# EasyEDA Pro project EasyEDA_Pro_Project_0.02.epro

# Schematic Schematic1
Board Name: Board1; Create Date: 2025-01-02; Page Name: P1; Project Name: MCU Dev Board - Microchip AVR64DU28; Schematic Name: Schematic1; Update Date: 2025-01-03; Company: EasyEDA.com; Page Size: A4; Version: V1.0
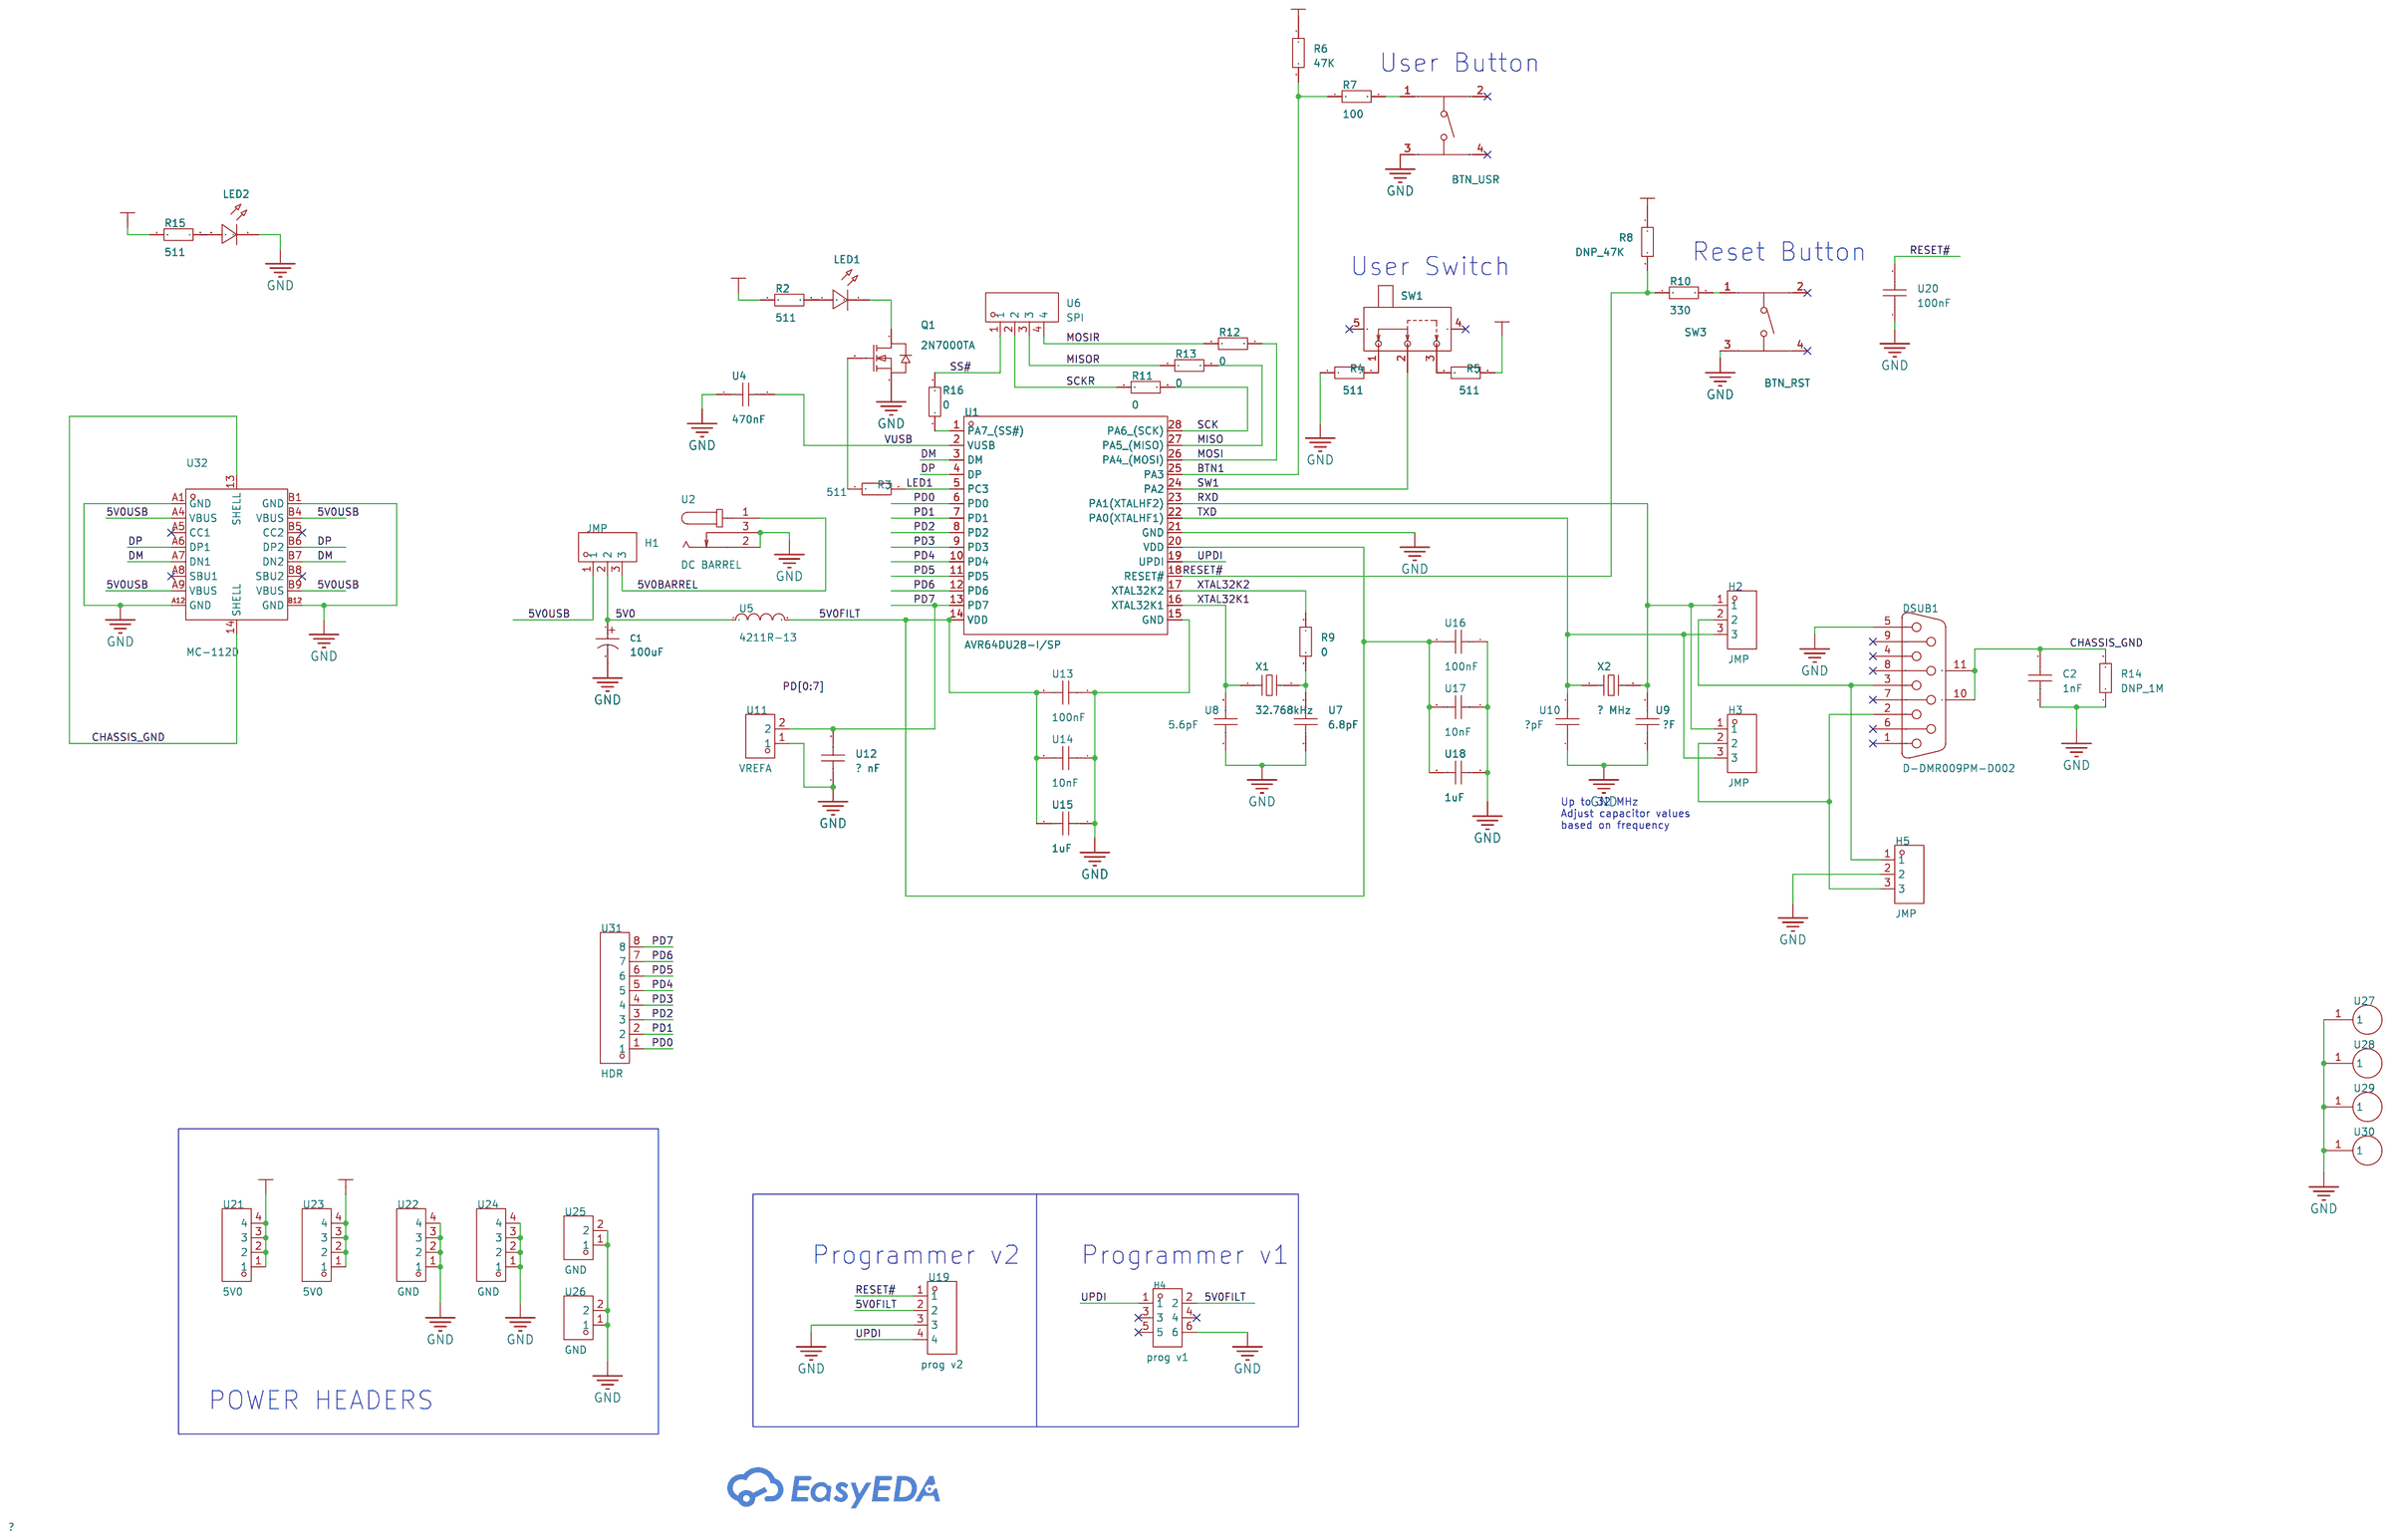
[diagram p0: schematic sheet]

## Parts
BTN_USR  GT-TC075B-H070-L1  [KEY-TH_4P-L4.5-W4.5-P3.00-LS5.8]
C1  100uF  [CAP-TH_BD5.0-P2.00-D0.8-FD]
C2  1nF  [CAP-TH_L6.0-W3.5-P7.50-D1.0]
DSUB1  D-DMR009PM-D002  [DSUB-TH_DMR-9P]
H1  JMP  [HDR-TH_3P-P2.54-V-M-1]
H2  JMP  [HDR-TH_3P-P2.54-V-M-1]
H3  JMP  [HDR-TH_3P-P2.54-V-M-1]
H4  prog v1  [HDR-TH_6P-P2.54-V-M-R2-C3-S2.54]
H5  JMP  [HDR-TH_3P-P2.54-V-M-1]
LED1  -  [LED-TH_BD3.0-P2.54-FD]
LED2  -  [LED-TH_BD3.0-P2.54-FD]
Q1  2N7000TA  [TO-92-3_L4.8-W3.7-P2.54-L]
R2  511  [RES-TH_BD1.8-L3.2-P7.20-D0.4]
R3  511  [RES-TH_BD1.8-L3.2-P7.20-D0.4]
R4  511  [RES-TH_BD1.8-L3.2-P7.20-D0.4]
R5  511  [RES-TH_BD1.8-L3.2-P7.20-D0.4]
R6  47K  [RES-TH_BD1.8-L3.2-P7.20-D0.4]
R7  100  [RES-TH_BD1.8-L3.2-P7.20-D0.4]
R8  DNP_47K  [RES-TH_BD1.8-L3.2-P7.20-D0.4]
R9  0  [RES-TH_BD1.8-L3.2-P7.20-D0.4]
R10  330  [RES-TH_BD1.8-L3.2-P7.20-D0.4]
R11  0  [RES-TH_BD1.8-L3.2-P7.20-D0.4]
R12  0  [RES-TH_BD1.8-L3.2-P7.20-D0.4]
R13  0  [RES-TH_BD1.8-L3.2-P7.20-D0.4]
R14  DNP_1M  [R_AXIAL-0.4]
R15  511  [RES-TH_BD1.8-L3.2-P7.20-D0.4]
R16  0  [RES-TH_BD1.8-L3.2-P7.20-D0.4]
SW1  SS-12D07G4  [SW-TH_DEALON_SS-12D02-VGX]
SW3  BTN_RST  [KEY-TH_4P-L4.5-W4.5-P3.00-LS5.8]
U1  AVR64DU28-I/SP  [SPDIP-28_L34.7-W7.2-P2.54-LS7.9-BL]
U2  DC BARREL  [DC-IN-TH_DC-005-2.0_C22459640]
U4  470nF  [CAP-TH_L4.8-W2.4-P5.08-D0.6]
U5  4211R-13  [IND-TH_BD3.5-L4.4_4211R-13]
U6  SPI  [HDR-TH_4P-P2.00-V-M]
U7  6.8pF  [CAP-TH_L4.8-W2.4-P5.08-D0.6]
U8  5.6pF  [CAP-TH_L4.8-W2.4-P5.08-D0.6]
U9  ?F  [CAP-TH_L4.8-W2.4-P5.08-D0.6]
U10  ?pF  [CAP-TH_L4.8-W2.4-P5.08-D0.6]
U11  VREFA  [HDR-TH_2P-P2.00-V-M]
U12  ? nF  [CAP-TH_L4.8-W2.4-P5.08-D0.6]
U13  100nF  [CAP-TH_L4.8-W2.4-P5.08-D0.6]
U14  10nF  [CAP-TH_L4.8-W2.4-P5.08-D0.6]
U15  1uF  [CAP-TH_L4.8-W2.4-P5.08-D0.6]
U16  100nF  [CAP-TH_L4.8-W2.4-P5.08-D0.6]
U17  10nF  [CAP-TH_L4.8-W2.4-P5.08-D0.6]
U18  1uF  [CAP-TH_L4.8-W2.4-P5.08-D0.6]
U19  prog v2  [HDR-TH_4P-P2.00-V-M]
U20  100nF  [CAP-TH_L4.8-W2.4-P5.08-D0.6]
U21  5V0  [HDR-TH_4P-P2.00-V-M]
U22  GND  [HDR-TH_4P-P2.00-V-M]
U23  5V0  [HDR-TH_4P-P2.00-V-M]
U24  GND  [HDR-TH_4P-P2.00-V-M]
U25  GND  [HDR-TH_2P-P2.00-V-M]
U26  GND  [HDR-TH_2P-P2.00-V-M]
U27  -  [Standoff 2.0mm]
U28  -  [Standoff 2.0mm]
U29  -  [Standoff 2.0mm]
U30  -  [Standoff 2.0mm]
U31  HDR  [HDR-TH_8P-P2.54-V-M]
U32  MC-112D  [USB-C-TH_HANBO_MC-112D]
X1  32.768kHz  [OSC-TH_BD2.0-P0.70-D0.3]
X2  ? MHz  [OSC-TH_BD2.0-P0.70-D0.3]

## Library data of the parts
BTN_USR SW3 = GT-TC075B-H070-L1: Circuit:SPST Actuator Style:Round Button Operating Force:250gf Mounting Style:Straight Switch Length:4.5mm Switch Width:4.5mm Switch Height:7mm Strike Gundam:不带 Contact Current:50mA Voltage Rating (DC):12V Insulation Resistance:100MΩ Actuator/Cap Color:Bl; LCSC Part Name: 4.5*4.5*7mm 直插 轻触开关; Supplier Part: C2829947; Manufacturer: G-Switch(品赞); Supplier Footprint: 插件; JLCPCB Part Class: Extended Part; Datasheet: https://atta.szlcsc.com/upload/public/pdf/source/20210430/C2829936_0F431FDF8267C5A6C94C8ADDACF09981.pdf; Supplier: LCSC; Circuit: SPST; Actuator Style: Round Button; Operating Force: 250gf; Mounting Style: Straight; Switch Length: 4.5mm; Switch Width: 4.5mm; Switch Height: 7mm; Strike Gundam: 不带; Contact Current: 50mA; Voltage Rating (DC): 12V; Insulation Resistance: 100MΩ; Actuator/Cap Color: Black; With Lamp: No; Pin Style: PCPin; Mechanical Life: 10万次; Operating Temperature: -30℃~+85℃
C1 = KS107M010D07RR0VH2FP0: Capacitance:100uF Tolerance:±20% Tolerance:±20% Rated Voltage: Ripple Current:50mA@120Hz Equivalent Series Resistance(ESR):- Lead Spacing: φD: L: Lifetime @ Temp:1000hrs@105℃ Operating Temperature:-40℃~+105℃ Operating Temperature:-40℃~+105℃; LCSC Part Name: 100uF ±20% 10V; Supplier Part: C43315; Manufacturer: CX(承兴); Supplier Footprint: 插件,D5xL7mm; JLCPCB Part Class: Extended Part; Datasheet: https://atta.szlcsc.com/upload/public/pdf/source/20211027/7B10195EF01EB9374BE8935690E3D906.pdf; Supplier: LCSC; Tolerance: ±20%; Ripple Current: 50mA@120Hz; Lifetime @ Temp: 1000hrs@105℃; Operating Temperature: -40℃~+105℃
C2 = Y25E1E102M: Capacitance: Tolerance:±20% Tolerance:±20% Voltage(AC):250V Subclass:; LCSC Part Name: 等级:Y2 1nF ±20% 250V; Supplier Part: C332370; Manufacturer: HEL(鸿志); Supplier Footprint: 插件,P=7.5mm; JLCPCB Part Class: Extended Part; Datasheet: https://atta.szlcsc.com/upload/public/pdf/source/20181130/C332372_EA8D2B597A88A824E44325E038B9D018.pdf; Supplier: LCSC; Tolerance: ±20%; Voltage(AC): 250V
DSUB1 = D-DMR009PM-D002: Connector Type:常规D-Sub Gender:Male Number of Pins:9P Mounting Style:Bend insert Number of Rows:2 Current Rating-Signal (Max):3A Current Rating-Power (Max):- Rated Voltage (Max):- Colour:Black Operating Temperature Range:-50℃~+105℃ Operating Temperature Ra; LCSC Part Name: D-Sub 公 P数:9P; Supplier Part: C141880; Manufacturer: Ckmtw(灿科盟); Supplier Footprint: 弯插; JLCPCB Part Class: Extended Part; Datasheet: https://atta.szlcsc.com/upload/public/pdf/source/20171123/C141880_15114109678101137623.pdf; Supplier: LCSC; Connector Type: 常规D-Sub; Gender: Male; Number of Pins: 9P; Mounting Style: Bend insert; Number of Rows: 2; Current Rating-Signal (Max): 3A; Colour: Black; Operating Temperature Range: -50℃~+105℃
H1-H3 H5 = 12251103CNG0S115001: Pin Structure:1x3P Pitch:2.54mm Row Spacing:- Circluar Pins/Square Pins:Policy Mounting Type:Direct Insert Number of Rows:Single Row Number of Pins:3P Current Rating (Max):3A Voltage Rating (Max):- Length of Mating Pin:6mm Insulation Height:2.5mm Length o; LCSC Part Name: 1x3P 间距:2.54mm 方针 直插; Supplier Part: C429954; Manufacturer: JILN(锦凌); Supplier Footprint: 插件,P=2.54mm; JLCPCB Part Class: Extended Part; Datasheet: https://atta.szlcsc.com/upload/public/pdf/source/20190920/C429964_97CF577D001CBBD1C5ADC89AE690F8A2.pdf; Supplier: LCSC; Pin Structure: 1x3P; Pitch: 2.54mm; Circluar Pins/Square Pins: Policy; Mounting Type: Direct Insert; Number of Rows: Single Row; Number of Pins: 3P; Current Rating (Max): 3A; Length of Mating Pin: 6mm; Insulation Height: 2.5mm; Length of End Connection Pin: 3mm; Contact Material: Brass; Operating Temperature Range: -40℃~+105℃; Soldering Temperature(Max): 200℃; Color: Black
H4 = PH-01291: Pin Structure:2x3P Pitch:2.54mm Row Spacing:2.54mm Circluar Pins/Square Pins:Square Pins Mounting Type:Straight Number of Rows:双排 Number of Pins:6P Current Rating (Max):3A Voltage Rating (Max):- Length of Mating Pin:6mm Insulation Height:2.5mm Length of E; LCSC Part Name: 间距:2.54mm 2x3P 直插 方针; Supplier Part: C2685197; Manufacturer: Liansheng(连盛); Supplier Footprint: 插件,P=2.54mm; JLCPCB Part Class: Extended Part; Datasheet: https://atta.szlcsc.com/upload/public/pdf/source/20210126/C2685197_BCDAC363C191DAD80284D75D76656869.pdf; Supplier: LCSC; Pin Structure: 2x3P; Pitch: 2.54mm; Row Spacing: 2.54mm; Circluar Pins/Square Pins: Square Pins; Mounting Type: Straight; Number of Rows: 双排; Number of Pins: 6P; Current Rating (Max): 3A; Length of Mating Pin: 6mm; Insulation Height: 2.5mm; Length of End Connection Pin: 3mm; Operating Temperature Range: -40℃~+105℃; Color: Black
LED1 LED2 = LED_TH-R_3mm: Supplier Footprint: Through
Q1 = 2N7000TA: Type:1 N-Channel Drain Source Voltage (Vdss): Continuous Drain Current (Id): Drain Source On Resistance (RDS(on)@Vgs,Id):1.2Ω@10V,500mA Power Dissipation (Pd): Gate Threshold Voltage (Vgs(th)@Id):2.1V@1mA Input Capacitance (Ciss@Vds):50pF@25V Reverse Tran; LCSC Part Name: 1个N沟道 耐压:60V 电流:200mA; Supplier Part: C107290; Manufacturer: onsemi(安森美); Supplier Footprint: TO-92-2.54mm; JLCPCB Part Class: Extended Part; Datasheet: https://atta.szlcsc.com/upload/public/pdf/source/20181011/C107290_B31B96F645D839A54C166B69C8A09EDB.pdf; Supplier: LCSC; Type: 1 N-Channel; Drain Source On Resistance (RDS(on)@Vgs,Id): 1.2Ω@10V,500mA; Gate Threshold Voltage (Vgs(th)@Id): 2.1V@1mA; Input Capacitance (Ciss@Vds): 50pF@25V; Reverse Transfer Capacitance (Crss@Vds): 5pF@25V; Operating Temperature: -55℃~+150℃
R2-R13 R15 R16 = Res_AXIAL-1/8W: Supplier Footprint: Through
R14 = Res_AXIAL-1/4W: Supplier Footprint: Through
SW1 = SS-12D07G4: LCSC Part Name: 拨动开关单排两档高度4; Supplier Part: C7471827; Manufacturer: HanElectricity(瀚源); JLCPCB Part Class: Extended Part; Datasheet: https://atta.szlcsc.com/upload/public/pdf/source/20230804/8F380914F6D2310095340BEFBA1166E2.pdf; Supplier: LCSC
U1 = AVR64DB28-I/SP: CPU Core:AVR Program Storage Size:64KB GPIO Ports Number:21 Operating Voltage Range:1.8V~5.5V Operating Voltage Range:1.8V~5.5V CPU Maximum Speed:24MHz Operating Temperature Range:-40℃~+85℃ Operating Temperature Range:-40℃~+85℃ ADC (Bit):12bit DAC (Bit):1; Supplier Part: C5239855; Manufacturer: MICROCHIP(美国微芯); Supplier Footprint: SPDIP-28-300mil; JLCPCB Part Class: Extended Part; Datasheet: https://atta.szlcsc.com/upload/public/pdf/source/20221107/0017966FE6A2719C2BE10DA466CCAD4F.pdf; Supplier: LCSC; CPU Core: AVR; Program Storage Size: 64KB; GPIO Ports Number: 21; Operating Voltage Range: 1.8V~5.5V; CPU Maximum Speed: 24MHz; Operating Temperature Range: -40℃~+85℃; ADC (Bit): 12bit; DAC (Bit): 10bit; Watchdog: 有; Low-Voltage Detect: 有; Internal Oscillator: 有
U2 = DC-005-2.0_C22459640: LCSC Part Name: DC-005-2.0; Supplier Part: C22459640; Manufacturer: HanElectricity(瀚源); Supplier Footprint: 插件; JLCPCB Part Class: Extended Part; Datasheet: https://atta.szlcsc.com/upload/public/pdf/source/20240612/482A6E3C5A13B157BCBF6F540A12A38A.pdf; Supplier: LCSC
U4 U7-U10 U12-U18 U20 = 178MU0009: Capacitance: Tolerance:±10% Tolerance:±10% Voltage Rated: Temperature Coefficient:; LCSC Part Name: 470nF ±10% 50V; Supplier Part: C5632433; Manufacturer: KNSCHA(科尼盛); Supplier Footprint: 插件,P=5.08mm; JLCPCB Part Class: Extended Part; Datasheet: https://atta.szlcsc.com/upload/public/pdf/source/20230506/DCC14A9A0FEAEE97AA63FFA7A16A3B41.pdf; Supplier: LCSC; Tolerance: ±10%
U5 = 4211R-13: Impedance @ Frequency:50Ω@100MHz Circuits:1; Supplier Part: C7015509; Manufacturer: API Delevan; Supplier Footprint: 插件,D3.5xL4.4mm; JLCPCB Part Class: Extended Part; Datasheet: https://atta.szlcsc.com/upload/public/pdf/source/20241031/AC5F627B4ECA19ABE3C427B5589A7B60.pdf; Supplier: LCSC; Impedance @ Frequency: 50Ω@100MHz; Circuits: 1
U6 U19 U21-U24 = P220-1104A0BS087A1: Pin Structure:1x4P Pitch:2mm Row Spacing:2mm Circluar Pins/Square Pins:Square Pins Mounting Type:Straight Number of Rows:Plugin Number of Pins:4P Length of Mating Pin:4mm Insulation Height:2mm Length of End Connection Pin:2.8mm Contact Material: Operating; LCSC Part Name: 1x4P 间距:2mm 方针 直插; Supplier Part: C7494801; Manufacturer: Yxcon(宇熙精密); Supplier Footprint: 插件,P=2mm; JLCPCB Part Class: Extended Part; Supplier: LCSC; Pin Structure: 1x4P; Pitch: 2mm; Row Spacing: 2mm; Circluar Pins/Square Pins: Square Pins; Mounting Type: Straight; Number of Rows: Plugin; Number of Pins: 4P; Length of Mating Pin: 4mm; Insulation Height: 2mm; Length of End Connection Pin: 2.8mm; Operating Temperature Range: -40℃~+105℃; Color: Black
U11 U25 U26 = HX PZ2.0-1x2P ZZ: Pin Structure:1x2P Pitch:2mm Row Spacing:- Circluar Pins/Square Pins:Policy Mounting Type:Direct Insert Number of Rows:Single Row Number of Pins:2P Current Rating (Max):1.5A Voltage Rating (Max):- Length of Mating Pin:3.9mm Insulation Height:2mm Length of; LCSC Part Name: 1x2P 间距:2mm 方针 直插 配套排母：HX PM2.0-1x2P系列 6T材质环保阻燃U认证; Supplier Part: C22438285; Manufacturer: hanxia(韩下); Supplier Footprint: 插件,P=2mm; JLCPCB Part Class: Extended Part; Datasheet: https://atta.szlcsc.com/upload/public/pdf/source/20240522/1FF787A01EEC3A9B4EEF5A5788C49F98.pdf; Supplier: LCSC; Pin Structure: 1x2P; Pitch: 2mm; Circluar Pins/Square Pins: Policy; Mounting Type: Direct Insert; Number of Rows: Single Row; Number of Pins: 2P; Current Rating (Max): 1.5A; Length of Mating Pin: 3.9mm; Insulation Height: 2mm; Length of End Connection Pin: 2.8mm; Contact Material: Phosphor Bronze; Contact Plating: Gold; Operating Temperature Range: -40℃~+105℃; Color: Black
U27-U30 = Standoff 2.0mm
U31 = HB-PH3-25418PB2GOP: Pin Structure:1x8P Pitch:2.54mm Row Spacing:2.54mm Circluar Pins/Square Pins:Policy Mounting Type:Direct Insert Number of Rows:Single Row Number of Pins:8P Current Rating (Max):3A Voltage Rating (Max):250V Length of Mating Pin:6mm Insulation Height:2.54mm; LCSC Part Name: 间距:2.54mm 1x8P 直插 方针; Supplier Part: C6332201; Manufacturer: HANBO(汉博); Supplier Footprint: 插件,P=2.54mm; JLCPCB Part Class: Extended Part; Datasheet: https://atta.szlcsc.com/upload/public/pdf/source/20230803/F72D259687963761DF1B552F3BB84A31.pdf; Supplier: LCSC; Pin Structure: 1x8P; Pitch: 2.54mm; Row Spacing: 2.54mm; Circluar Pins/Square Pins: Policy; Mounting Type: Direct Insert; Number of Rows: Single Row; Number of Pins: 8P; Current Rating (Max): 3A; Voltage Rating (Max): 250V; Length of Mating Pin: 6mm; Insulation Height: 2.54mm; Length of End Connection Pin: 3mm; Contact Material: Brass; Contact Plating: Gold; Operating Temperature Range: -40℃~+105℃; Soldering Temperature(Max): 260℃; Color: Black
U32 = MC-112D: Connector Type:Type-C Standard:USB 3.1 Gender:Female Number of Ports:1 Number of Contacts:16P Mounting Style:卧贴 Current Rating - Power (Max):5A Contact Material:- Contact Plating:- Operating Temperature Range:-25℃~+85℃ Operating Temperature Range:-25℃~+85; LCSC Part Name: Type-C 母 卧贴; Supplier Part: C3039305; Manufacturer: HANBO(汉博); Supplier Footprint: 插件; JLCPCB Part Class: Extended Part; Datasheet: https://atta.szlcsc.com/upload/public/pdf/source/20221111/05E91E092B8C9D9AB1C7A8D6A1223CF1.pdf; Supplier: LCSC; Connector Type: Type-C; Standard: USB 3.1; Gender: Female; Number of Ports: 1; Number of Contacts: 16P; Mounting Style: 卧贴; Current Rating - Power (Max): 5A; Operating Temperature Range: -25℃~+85℃
X1 X2 = TAXD32768K2BGBBZT2S: Crystal Type:Through-Hole Crystal Oscillator Frequency: Normal temperature Frequency Tolerance:±10ppm Normal temperature Frequency Tolerance:±10ppm Load Capacitor: Equivalent Series Resistance (ESR):40kΩ Operating Temperature: Operating Temperature:; LCSC Part Name: 32.768kHz ±10ppm 12.5pF; Supplier Part: C511702; Manufacturer: YJX(雅晶鑫); Supplier Footprint: DT-26; JLCPCB Part Class: Extended Part; Datasheet: https://atta.szlcsc.com/upload/public/pdf/source/20200413/C511702_53213EE64118537F2B1B6857476EB6FF.pdf; Supplier: LCSC; Crystal Type: Through-Hole Crystal Oscillator; Normal temperature Frequency Tolerance: ±10ppm; Equivalent Series Resistance (ESR): 40kΩ

## Nets
5V0: C1.1 H1.2 R2.2 R5.2 R6.1 R8.1 R15.2 U5.1 U21.1 U21.2 U21.3 U21.4 U23.1 U23.2 U23.3 U23.4
5V0BARREL: H1.3 U2.1
5V0FILT: H4.2 U1.14(VDD) U1.20(VDD) U5.2 U13.2 U14.2 U15.2 U16.2 U17.2 U18.2 U19.2
5V0USB: H1.1 U32.A4(VBUS) U32.A9(VBUS) U32.B4(VBUS) U32.B9(VBUS)
GND: BTN_USR.3 C1.2 C2.2 DSUB1.5 H4.6 H5.2 LED2.2(A) Q1.1(S) R4.1 R14.1 SW3.3 U1.15(GND) U1.21(GND) U2.2 U2.3 U4.1 U7.1 U8.1 U9.1 U10.1 U11.1 U12.1 U13.1 U14.1 U15.1 U16.1 U17.1 U18.1 U19.3 U20.1 U22.1 U22.2 U22.3 U22.4 U24.1 U24.2 U24.3 U24.4 U25.1 U25.2 U26.1 U26.2 U27.1 U28.1 U29.1 U30.1 U32.A1(GND) U32.A12(GND) U32.B1(GND) U32.B12(GND)
BTN1: R6.2 R7.1 U1.25(PA3)
CHASSIS_GND: C2.1 DSUB1.10(MH1) DSUB1.11(MH2) R14.2 U32.13(SHELL) U32.14(SHELL)
DM: U1.3(DM) U32.A7(DN1) U32.B7(DN2)
DP: U1.4(DP) U32.A6(DP1) U32.B6(DP2)
LED1: R3.2 U1.5(PC3)
MISO: R13.2 U1.27(PA5 (MISO))
MISOR: R13.1 U6.3
MOSI: R12.2 U1.26(PA4 (MOSI))
MOSIR: R12.1 U6.4
PD0: U1.6(PD0) U31.1
PD1: U1.7(PD1) U31.2
PD2: U1.8(PD2) U31.3
PD3: U1.9(PD3) U31.4
PD4: U1.10(PD4) U31.5
PD5: U1.11(PD5) U31.6
PD6: U1.12(PD6) U31.7
PD7: U1.13(PD7) U11.2 U12.2 U31.8
RESET#: R8.2 R10.1 U1.18(RESET#) U19.1 U20.2
RXD: H2.1 H3.1 U1.23(PA1(XTALHF2)) U9.2 X2.2
SCK: R11.2 U1.28(PA6 (SCK))
SCKR: R11.1 U6.2
SS#: R16.2 U6.1
SW1: SW1.2 U1.24(PA2)
TXD: H2.3 H3.3 U1.22(PA0(XTALHF1)) U10.2 X2.1
UPDI: H4.1 U1.19(UPDI) U19.4
VUSB: U1.2(VUSB) U4.2
XTAL32K1: U1.16(XTAL32K1) U8.2 X1.1
XTAL32K2: R9.1 U1.17(XTAL32K2)
$1N1189: LED1.1(C) R2.1
$1N1310: Q1.2(G) R3.1
$1N1315: LED1.2(A) Q1.3(D)
$1N2118: R4.2 SW1.1
$1N2146: R5.1 SW1.3
$1N2686: R9.2 U7.2 X1.2
$1N3199: DSUB1.3 H2.2 H5.1
$1N3303: DSUB1.2 H3.2 H5.3
$1N7708: LED2.1(C) R15.1
$1N7767: R16.1 U1.1(PA7 (SS#))
$1N9356: BTN_USR.1 R7.2
$1N9378: R10.2 SW3.1

Not connected (* = marked no-connect by the designer): BTN_USR 2* 4*; DSUB1 1* 4* 6* 7* 8* 9*; H4 3* 4* 5*; SW1 4* 5*; SW3 2* 4*; U32 A5(CC1)* A8(SBU1)* B5(CC2)* B8(SBU2)*

## Notes on the sheet
- User Button
- Reset Button
- User Switch
- Up to 32 MHz
  Adjust capacitor values
  based on frequency
- Programmer v2
- Programmer v1
- POWER HEADERS

# Board PCB1
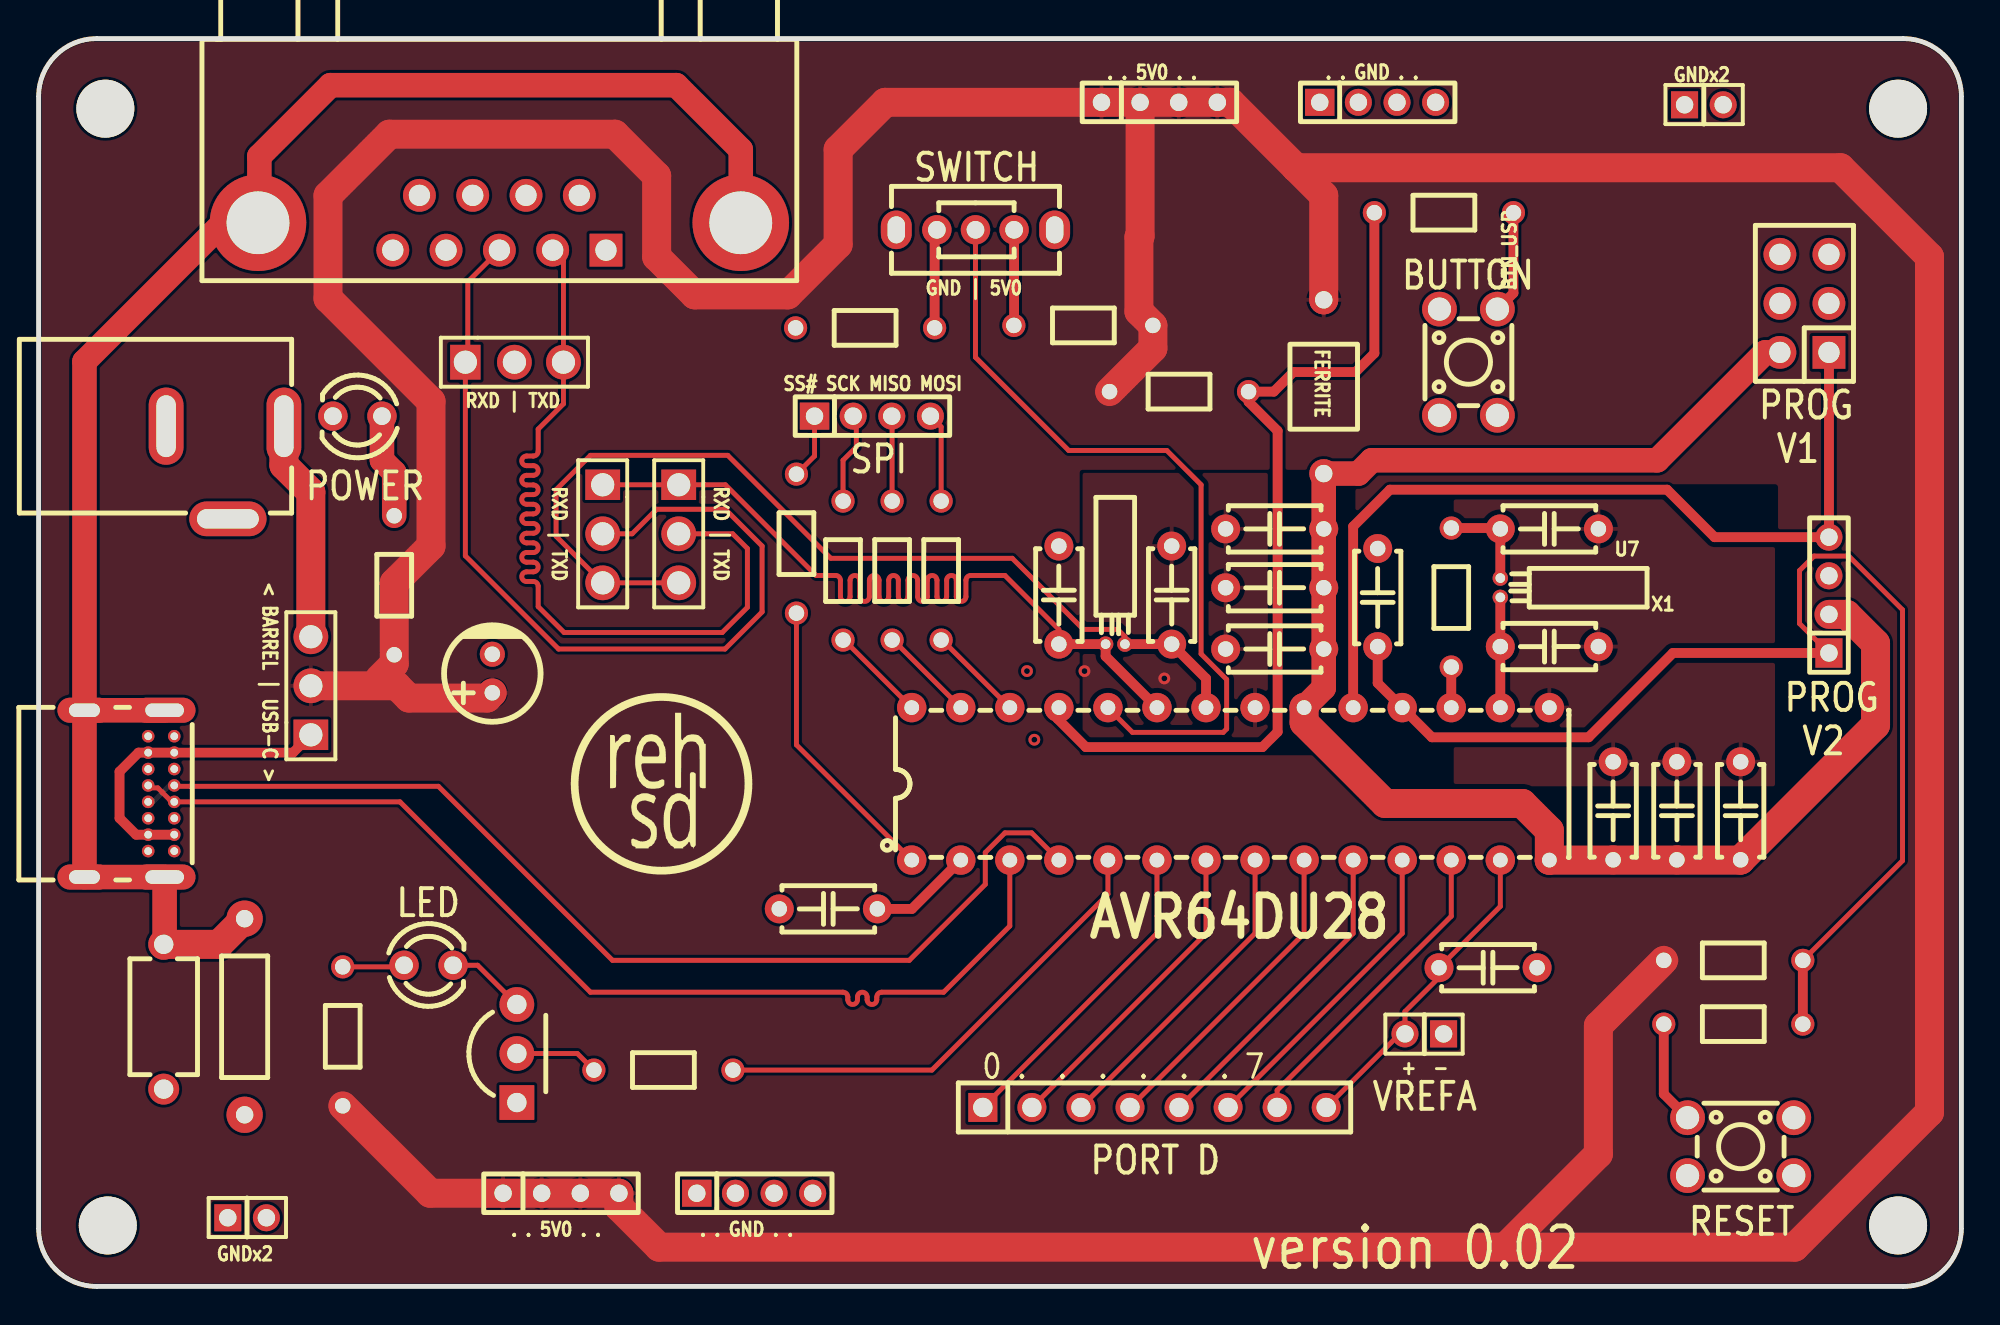
[diagram p1: board, top side]
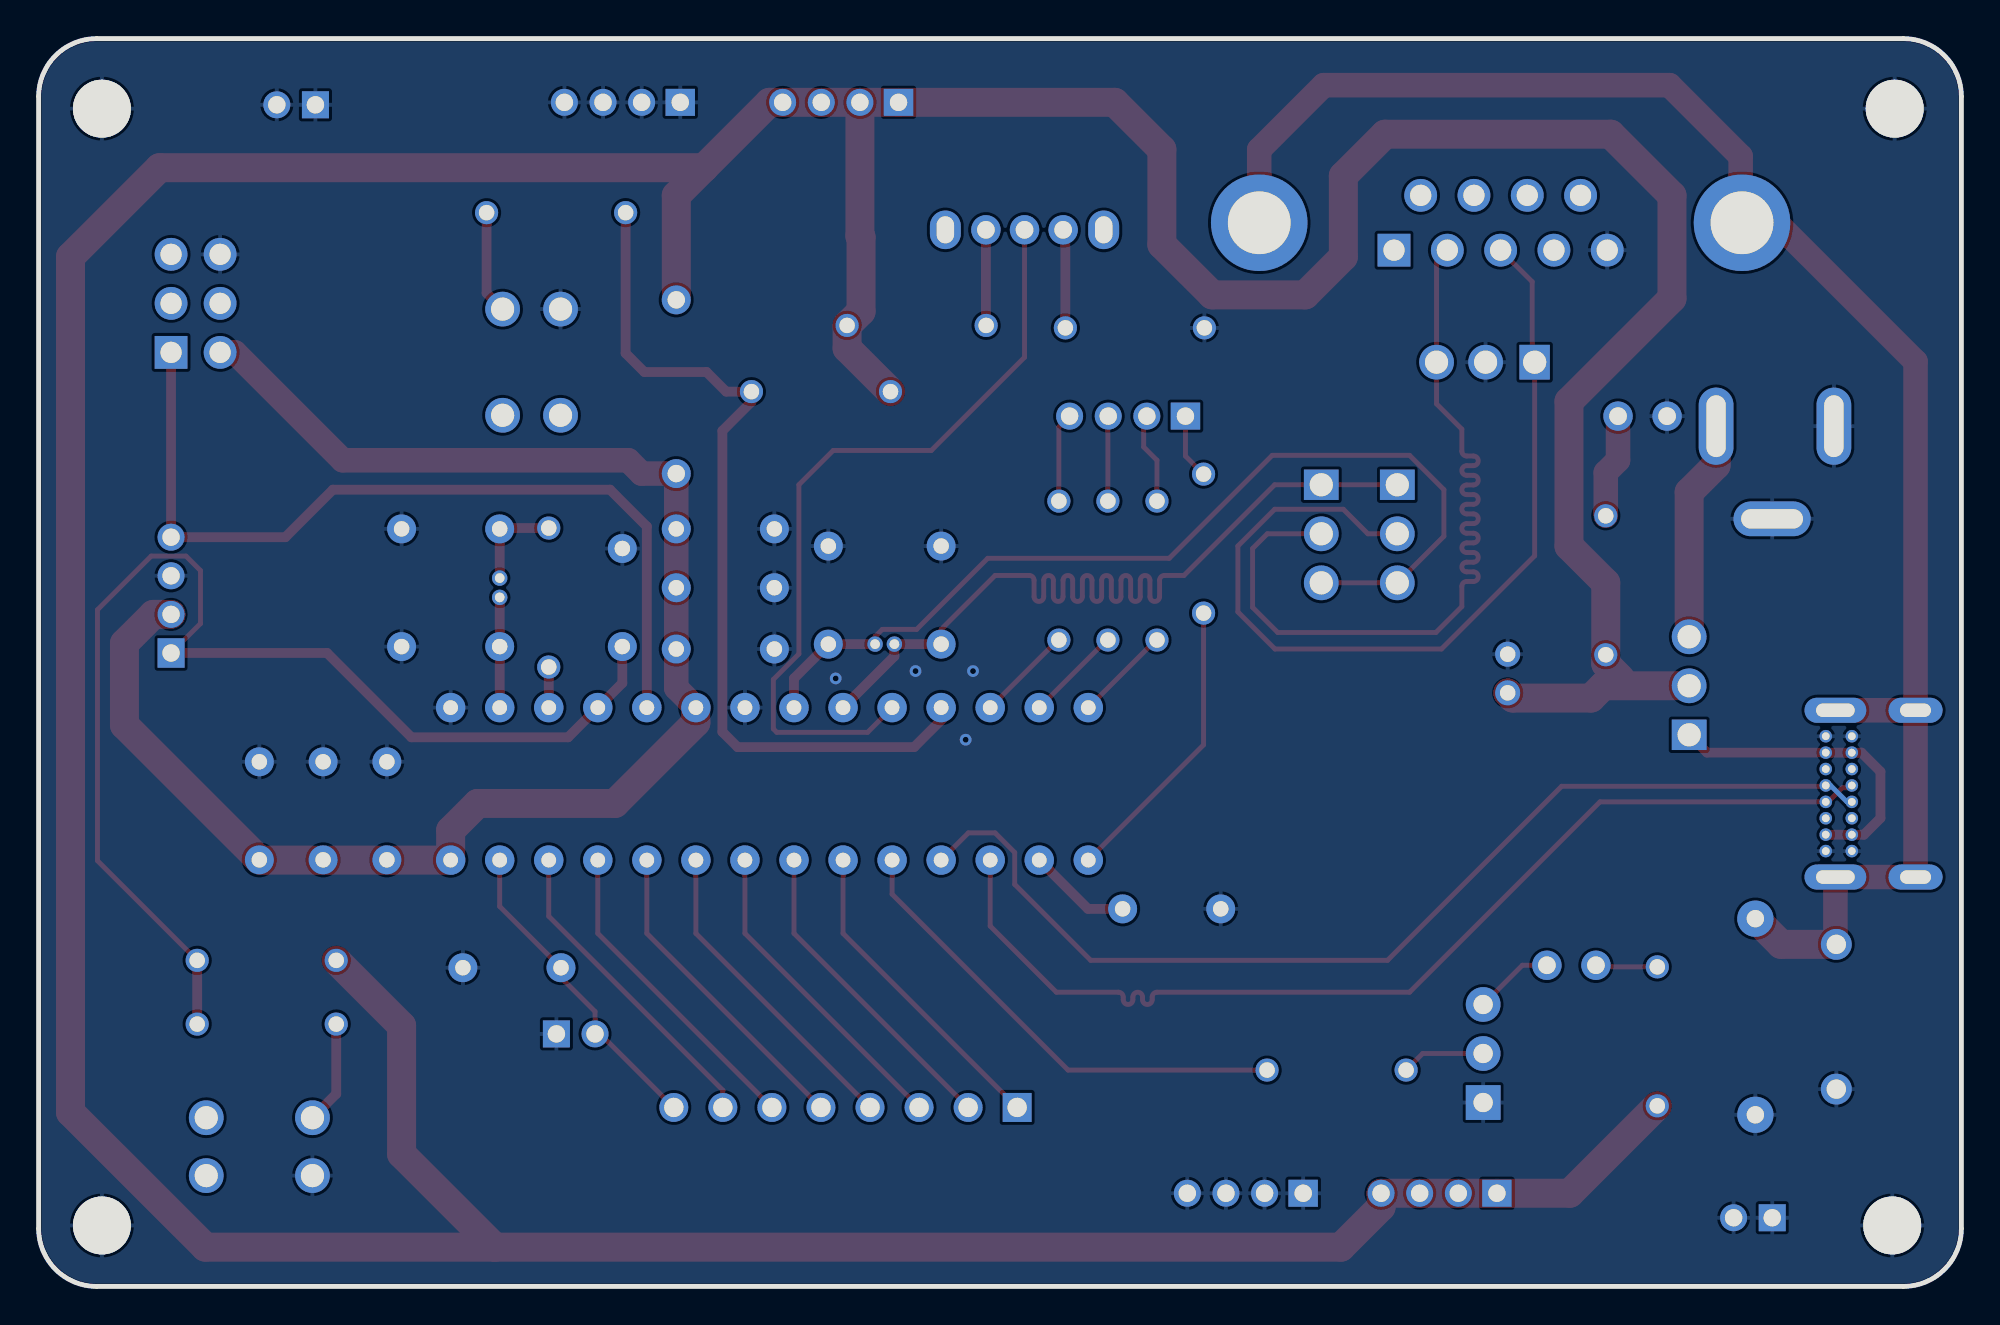
[diagram p2: board, bottom side, seen from below]

Outline 99.57 x 64.64 mm; copper layers: Top Layer, Bottom Layer. Coordinates in mm from the lower left corner of the outline.
Outline path: 0,61.64 0,3 arc(0.88,0.88) 3,0 96.57,0 arc(98.69,0.88) 99.57,3 99.57,61.64 arc(98.69,63.76) 96.57,64.64 3,64.64 arc(0.88,63.76) 0,61.64
Stack: Top Layer 0.035mm / Dielectric1 1.51mm FR4 er 4.5 / Bottom Layer 0.035mm

## Design rules (mm)
net DM: USB1
net DP: USB1
template: JLCPCB Capability(Two Layers Board)
spacing copperThickness1oz (default): track to track 0.102, other pairs 0.152 to 0.3
spacing copperThickness2oz: track to track 0.203, other pairs 0.152 to 0.3
track width copperThickness1oz (default): min 0.127, default 0.254, max 2.54
track width copperThickness2oz: min 0.203, default 0.254, max 2.54
differential pair differentialPair (default): width min 0.127, default 0.254, max 2.54; gap min 0.152, default 0.152
via viaSize (default): diameter min 0.5, default 0.61, max 10; hole min 0.3, default 0.305, max 6.3

## Placement (name value [footprint] x y rotation side)
BTN_USR  GT-TC075B-H070-L1  [KEY-TH_4P-L4.5-W4.5-P3.00-LS5.8]  74.04 47.88 270 top
C1  100uF  [CAP-TH_BD5.0-P2.00-D0.8-FD]  23.5 31.75 90 top
C2  1nF  [CAP-TH_L6.0-W3.5-P7.50-D1.0]  6.48 13.97 270 top
DSUB1  D-DMR009PM-D002  [DSUB-TH_DMR-9P]  23.86 55.1 90 top
H1  JMP  [HDR-TH_3P-P2.54-V-M-1]  14.1 31.11 90 top
H2  JMP  [HDR-TH_3P-P2.54-V-M-1]  29.21 38.99 270 top
H3  JMP  [HDR-TH_3P-P2.54-V-M-1]  33.15 38.99 270 top
H4  prog v1  [HDR-TH_6P-P2.54-V-M-R2-C3-S2.54]  91.44 50.93 90 top
H5  JMP  [HDR-TH_3P-P2.54-V-M-1]  24.64 47.88 0 top
LED1  -  [LED-TH_BD3.0-P2.54-FD]  20.19 16.64 0 top
LED2  -  [LED-TH_BD3.0-P2.54-FD]  16.51 45.08 180 top
Q1  2N7000TA  [TO-92-3_L4.8-W3.7-P2.54-L]  24.77 12.06 90 top
R2  511  [RES-TH_BD1.8-L3.2-P7.20-D0.4]  15.75 12.95 270 top
R3  511  [RES-TH_BD1.8-L3.2-P7.20-D0.4]  32.35 11.21 0 top
R4  511  [RES-TH_BD1.8-L3.2-P7.20-D0.4]  42.8 49.66 0 top
R5  511  [RES-TH_BD1.8-L3.2-P7.20-D0.4]  54.1 49.78 0 top
R6  47K  [RES-TH_BD1.8-L3.2-P7.20-D0.4]  59.06 46.36 0 top
R7  100  [RES-TH_BD1.8-L3.2-P7.20-D0.4]  72.77 55.63 0 top
R8  DNP_47K  [RES-TH_BD1.8-L3.2-P7.20-D0.4]  87.76 16.89 0 top
R9  0  [RES-TH_BD1.8-L3.2-P7.20-D0.4]  73.15 35.69 90 top
R10  330  [RES-TH_BD1.8-L3.2-P7.20-D0.4]  87.76 13.59 180 top
R11  0  [RES-TH_BD1.8-L3.2-P7.20-D0.4]  41.66 37.08 270 top
R12  0  [RES-TH_BD1.8-L3.2-P7.20-D0.4]  46.74 37.08 270 top
R13  0  [RES-TH_BD1.8-L3.2-P7.20-D0.4]  44.2 37.08 270 top
R14  DNP_1M  [R_AXIAL-0.4]  10.67 13.97 90 top
R15  511  [RES-TH_BD1.8-L3.2-P7.20-D0.4]  18.42 36.32 270 top
R16  0  [RES-TH_BD1.8-L3.2-P7.20-D0.4]  39.24 38.48 90 top
SW1  SS-12D07G4  [SW-TH_DEALON_SS-12D02-VGX]  48.51 54.74 0 top
SW3  BTN_RST  [KEY-TH_4P-L4.5-W4.5-P3.00-LS5.8]  88.14 7.24 0 top
U1  AVR64DU28-I/SP  [SPDIP-28_L34.7-W7.2-P2.54-LS7.9-BL]  61.72 26.03 0 top
U2  DC BARREL  [DC-IN-TH_DC-005-2.0_C22459640]  9.65 42.16 0 top
U4  470nF  [CAP-TH_L4.8-W2.4-P5.08-D0.6]  40.89 19.56 0 top
U5  4211R-13  [IND-TH_BD3.5-L4.4_4211R-13]  66.55 46.61 270 top
U6  SPI  [HDR-TH_4P-P2.00-V-M]  43.18 45.08 0 top
U7  6.8pF  [CAP-TH_L4.8-W2.4-P5.08-D0.6]  78.23 39.24 180 top
U8  5.6pF  [CAP-TH_L4.8-W2.4-P5.08-D0.6]  78.23 33.15 180 top
U9  ?F  [CAP-TH_L4.8-W2.4-P5.08-D0.6]  52.83 35.81 270 top
U10  ?pF  [CAP-TH_L4.8-W2.4-P5.08-D0.6]  58.67 35.81 270 top
U11  VREFA  [HDR-TH_2P-P2.00-V-M]  71.75 13.08 180 top
U12  ? nF  [CAP-TH_L4.8-W2.4-P5.08-D0.6]  75.06 16.51 180 top
U13  100nF  [CAP-TH_L4.8-W2.4-P5.08-D0.6]  64.01 33.02 0 top
U14  10nF  [CAP-TH_L4.8-W2.4-P5.08-D0.6]  64.01 36.19 0 top
U15  1uF  [CAP-TH_L4.8-W2.4-P5.08-D0.6]  64.01 39.24 0 top
U16  100nF  [CAP-TH_L4.8-W2.4-P5.08-D0.6]  81.53 24.64 270 top
U17  10nF  [CAP-TH_L4.8-W2.4-P5.08-D0.6]  84.84 24.64 270 top
U18  1uF  [CAP-TH_L4.8-W2.4-P5.08-D0.6]  88.14 24.64 270 top
U19  prog v2  [HDR-TH_4P-P2.00-V-M]  92.71 35.81 90 top
U20  100nF  [CAP-TH_L4.8-W2.4-P5.08-D0.6]  69.34 35.69 270 top
U21  5V0  [HDR-TH_4P-P2.00-V-M]  58.04 61.34 0 top
U22  GND  [HDR-TH_4P-P2.00-V-M]  69.34 61.34 0 top
U23  5V0  [HDR-TH_4P-P2.00-V-M]  27.05 4.83 0 top
U24  GND  [HDR-TH_4P-P2.00-V-M]  37.08 4.83 0 top
U25  GND  [HDR-TH_2P-P2.00-V-M]  86.23 61.21 0 top
U26  GND  [HDR-TH_2P-P2.00-V-M]  10.8 3.56 0 top
U27  -  [Standoff 2.0mm]  96.29 3.16 0 top
U28  -  [Standoff 2.0mm]  96.29 61.01 0 top
U29  -  [Standoff 2.0mm]  3.58 3.16 0 top
U30  -  [Standoff 2.0mm]  3.45 61.01 0 top
U31  HDR  [HDR-TH_8P-P2.54-V-M]  57.78 9.27 0 top
U32  MC-112D  [USB-C-TH_HANBO_MC-112D]  4.7 25.53 270 top
X1  32.768kHz  [OSC-TH_BD2.0-P0.70-D0.3]  75.69 36.19 180 top
X2  ? MHz  [OSC-TH_BD2.0-P0.70-D0.3]  55.75 33.27 270 top

## Footprints (pads in the part's own frame, mm; a bottom-side part is the same pattern mirrored in y, then rotated)
CAP-TH_BD5.0-P2.00-D0.8-FD
  round 1.3 hole 0.8: 1(-1,0) 2(1,0)
CAP-TH_L4.8-W2.4-P5.08-D0.6
  round 1.5 hole 0.8: 1(-2.54,0) 2(2.54,0)
CAP-TH_L6.0-W3.5-P7.50-D1.0
  round 1.6 hole 1: 1(-3.75,0) 2(3.75,0)
DC-IN-TH_DC-005-2.0_C22459640
  oval 1.8x4 hole 1x3.2: 1(3.05,2.4) 2(-3.05,2.4)
  oval 4x1.8 hole 3.2x1: 3(0.15,-2.4)
DSUB-TH_DMR-9P
  rect 1.7x1.7 hole 1.1: 1(-1.42,-5.52)
  round 1.7 hole 1.1: 2(-1.42,-2.76) 3(-1.42,0) 4(-1.42,2.76) 5(-1.42,5.52) 6(1.42,-4.14) 7(1.42,-1.38) 8(1.42,1.38) 9(1.42,4.14)
  round 5 hole 3.25: 10(0,12.5) 11(0,-12.5)
HDR-TH_2P-P2.00-V-M
  rect 1.4x1.4 hole 0.9: 1(-1,0)
  round 1.4 hole 0.9: 2(1,0)
HDR-TH_3P-P2.54-V-M-1
  rect 1.575x1.8 hole 1.2: 1(-2.54,0)
  round 1.8 hole 1.2: 2(0,0) 3(2.54,0)
HDR-TH_4P-P2.00-V-M
  rect 1.524x1.4 hole 0.9: 1(-3,0)
  round 1.4 hole 0.9: 2(-1,0) 3(1,0) 4(3,0)
HDR-TH_6P-P2.54-V-M-R2-C3-S2.54
  rect 1.7x1.7 hole 1.1: 1(-2.54,-1.27)
  round 1.7 hole 1.1: 2(-2.54,1.27) 3(0,-1.27) 4(0,1.27) 5(2.54,-1.27) 6(2.54,1.27)
HDR-TH_8P-P2.54-V-M
  rect 1.5x1.5 hole 1: 1(-8.89,0)
  round 1.5 hole 1: 2(-6.35,0) 3(-3.81,0) 4(-1.27,0) 5(1.27,0) 6(3.81,0) 7(6.35,0) 8(8.89,0)
IND-TH_BD3.5-L4.4_4211R-13
  round 1.5 hole 0.9: 1(-4.5,0) 2(4.5,0)
KEY-TH_4P-L4.5-W4.5-P3.00-LS5.8
  round 1.8 hole 1.2: 1(-2.75,1.5) 2(2.75,1.5) 3(-2.75,-1.5) 4(2.75,-1.5)
LED-TH_BD3.0-P2.54-FD
  round 1.524 hole 0.914: 1(-1.27,0) 2(1.27,0)
OSC-TH_BD2.0-P0.70-D0.3
  round 0.8 hole 0.5: 1(0,0.5) 2(0,-0.5)
R_AXIAL-0.4
  round 1.879 hole 0.899: 1(-5.08,0) 2(5.08,0)
RES-TH_BD1.8-L3.2-P7.20-D0.4
  round 1.2 hole 0.8: 1(-3.6,0) 2(3.6,0)
SPDIP-28_L34.7-W7.2-P2.54-LS7.9-BL
  round 1.524 hole 0.762: 1(-16.509,-3.95) 2(-13.97,-3.95) 3(-11.43,-3.95) 4(-8.89,-3.95) 5(-6.35,-3.95) 6(-3.81,-3.95) 7(-1.27,-3.95) 8(1.27,-3.95) 9(3.81,-3.95) 10(6.35,-3.95) 11(8.89,-3.95) 12(11.43,-3.95) 13(13.97,-3.95) 14(16.51,-3.95) 15(16.51,3.95) 16(13.97,3.95) 17(11.43,3.95) 18(8.89,3.95) 19(6.35,3.95) 20(3.81,3.95) 21(1.27,3.95) 22(-1.27,3.95) 23(-3.809,3.95) 24(-6.349,3.95) 25(-8.889,3.95) 26(-11.43,3.95) 27(-13.97,3.95) 28(-16.509,3.95)
Standoff 2.0mm
  round 3 hole 3x2: 1(0,0)
SW-TH_DEALON_SS-12D02-VGX
  round 1.524 hole 0.914: 1(-2,0) 2(0,0) 3(2,0)
  oval 1.6x2 hole 0.9x1.4: 4(4.1,0) 5(-4.1,0)
TO-92-3_L4.8-W3.7-P2.54-L
  rect 1.8x1.8 hole 1: 1(-2.54,0)
  round 1.8 hole 1: 2(0,0) 3(2.54,0)
USB-C-TH_HANBO_MC-112D
  oval 1.3x3.2 hole 0.7x2: 13(-4.32,1.825) 13(4.32,1.825)
  oval 1.3x2.8 hole 0.7x1.6: 14(-4.32,-2.325) 14(4.32,-2.325)
  round 0.65 hole 0.4: A1(-2.975,2.325) A4(-2.125,2.325) A5(-1.275,2.325) A6(-0.425,2.325) A7(0.425,2.325) A8(1.275,2.325) A9(2.125,2.325) A12(2.975,2.325) B1(2.975,0.975) B4(2.125,0.975) B5(1.275,0.975) B6(0.425,0.975) B7(-0.425,0.975) B8(-1.275,0.975) B9(-2.125,0.975) B12(-2.975,0.975)

## Nets
As in the schematic.

Pads without a net: BTN_USR 2 4; DSUB1 1 4 6 7 8 9; H4 3 4 5; SW1 4 5; SW3 2 4; U32 A5 A8 B5 B8

## Via types
v1: diameter 0.61, hole 0.305, Top Layer to Bottom Layer, 4 vias

## Routing (per net, layer and track width the routed paths; a pad name or vN(x,y) marks a point on that pad's centre or on a via; arc(x,y) is an arc through that point)
5V0: length 313.4
  Top Layer w1.5: C1.1 23.22,30.48 19.18,30.48 18.54,31.11 H1.2
  Top Layer w1.501: 75.95,2.03 80.77,6.86 80.77,13.51 R8.1 ; 75.95,2.03 90.93,2.03 97.92,9.02 97.92,53.34 93.3,57.96 65.11,57.96 ; 75.95,2.03 32.13,2.03 30.05,4.11 U23.4 U23.3 U23.2 U23.1 20.28,4.83 R2.2 ; U21.2 57.04,54.42 56.98,54.36 56.98,50.51 R5.2 57.7,48.6 R6.1 ; U21.2 U21.1 43.84,61.34 41.4,58.9 41.4,53.97 38.79,51.37 33.98,51.37 32,53.34 32,57.53 29.84,59.69 18.16,59.69 14.99,56.52 14.99,51.18 20.32,45.85 20.32,38.35 18.42,36.45 18.42,32.26 17.65,31.5 ; U21.2 U21.3 U21.4 61.72,61.34 65.11,57.96 ; U5.1 66.55,56.52 65.11,57.96
5V0BARREL: length 11.5
  Top Layer w1.5: H1.3 14.1,41.15 12.7,42.54 U2.1
5V0FILT: length 83.1
  Top Layer w1.27: H4.2 89.41,48.39 83.82,42.8 69.03,42.8 68.34,42.11 U5.2 U15.2 U14.2 U13.2 66.55,31 U1.20
  Top Layer w1.501: U1.20 65.53,29.21 69.72,25.02 76.84,25.02 78.23,23.62 U1.14 88.12,22.08 U18.2 95.12,29.08 95.12,33.31 93.62,34.81 U19.2
5V0USB: length 16.3
  Top Layer w0.5: 14.1,28.58 13.17,27.65 U32.A4
  Top Layer w0.508: U32.A9 U32.B4 5.05,23.4 4.19,24.26 4.19,26.67 5.17,27.65 U32.B9 U32.A4
GND:
  vias: v1(51.18,31.88) v1(51.56,28.32) v1(54.16,31.88) v1(58.29,31.5)
BTN1: length 45.8
  Top Layer w0.508: R7.1 69.17,48.34 68.2,47.37 64.98,47.37 63.96,46.36 R6.2 62.66,45.83 64.16,44.32 64.16,28.73 63.37,27.94 54.23,27.94 52.76,29.41 52.83,29.48 U1.25
CHASSIS_GND: length 90.3
  Top Layer w1.27: U32.14 U32.13 ; U32.14 U32.14 U32.13 6.52,17.77 C2.1 ; U32.14 2.37,47.91 9.56,55.1 DSUB1.10 11.43,55.17 11.43,58.55 15.11,62.23 33.02,62.23 36.36,58.89 DSUB1.11
  Top Layer w1.501: R14.2 9.34,17.72 C2.1
DM: length 55.6
  Top Layer w0.254: U1.3 50.29,18.67 46.86,15.24 43.65,15.24 arc(43.48,15.17) 43.4,14.99 43.4,14.86 arc(43.15,14.61) 42.9,14.86 42.9,14.99 arc(42.65,15.24) 42.4,14.99 42.4,14.86 arc(42.15,14.61) 41.9,14.86 41.9,14.99 arc(41.83,15.17) 41.65,15.24 28.57,15.24 18.71,25.1 U32.A7 6.9,25.1 6.78,25.22 6.77,25.22 6.42,25.58 6.42,25.58 6.17,25.83 5.8,25.83 U32.B7
DP: length 55.5
  Top Layer w0.254: U32.A6 7.07,25.91 20.7,25.91 29.72,16.89 45.09,16.89 49.02,20.83 49.02,22.48 50.04,23.5 51.42,23.5 U1.4
  Bottom Layer w0.254: U32.B6 5.92,25.1 6.78,25.95 U32.A6
LED1: length 25
  Top Layer w0.254: U1.5 55.37,20.32 46.26,11.21 R3.2
MISO: length 5
  Top Layer w0.254: U1.27 44.25,33.48 R13.2
MISOR: length 4.4
  Top Layer w0.254: U6.3 44.2,45.07 R13.1
MOSI: length 5
  Top Layer w0.254: U1.26 46.79,33.48 R12.2
MOSIR: length 4.6
  Top Layer w0.254: U6.4 46.74,44.53 R12.1
PD0: length 16.5
  Top Layer w0.254: 48.9,9.27 57.91,18.29 U1.6
PD1: length 16.5
  Top Layer w0.254: U31.2 60.45,18.29 U1.7
PD2: length 16.5
  Top Layer w0.254: U31.3 62.99,18.29 U1.8
PD3: length 16.5
  Top Layer w0.254: U1.9 65.53,18.29 U31.4
PD4: length 16.5
  Top Layer w0.254: U31.5 68.07,18.29 U1.10
PD5: length 16.5
  Top Layer w0.254: U31.6 70.61,18.29 U1.11
PD6: length 16.5
  Top Layer w0.254: U31.7 64.13,10.16 73.15,19.18 U1.12
PD7: length 16.7
  Top Layer w0.254: U1.13 75.69,19.69 U12.2 72.52,16 70.75,14.24 U11.2 70.49,13.08 U31.8
RESET#: length 63.5
  Top Layer w0.254: R8.2 96.52,22.05 96.52,35.05 93.74,37.83 91.94,37.83 91.19,37.08 91.19,34.34 U19.1
  Top Layer w0.508: R10.1 R8.2 ; 69.34,33.15 69.34,31.25 U1.18 72.15,28.45 80.26,28.45 84.63,32.81 U19.1
RXD: length 50.1
  Top Layer w0.254: U9.2 52.83,34.04 50.04,36.83 48.27,36.83 arc(48.09,36.76) 48.02,36.58 48.02,35.73 arc(47.77,35.48) 47.52,35.73 47.52,36.58 arc(47.27,36.83) 47.02,36.58 47.02,35.73 arc(46.77,35.48) 46.52,35.73 46.52,36.58 arc(46.27,36.83) 46.02,36.58 46.02,35.73 arc(45.77,35.48) 45.52,35.73 45.52,36.58 arc(45.27,36.83) 45.02,36.58 45.02,35.73 arc(44.77,35.48) 44.52,35.73 44.52,36.58 arc(44.27,36.83) 44.02,36.58 44.02,35.73 arc(43.77,35.48) 43.52,35.73 43.52,36.58 arc(43.27,36.83) 43.02,36.58 43.02,35.73 arc(42.77,35.48) 42.52,35.73 42.52,36.58 arc(42.27,36.83) 42.02,36.58 42.02,35.73 arc(41.77,35.48) 41.52,35.73 41.52,36.58 arc(41.45,36.76) 41.27,36.83 40.26,36.83 35.56,41.53 29.21,41.53
  Top Layer w0.508: U1.23 55.25,32.64 X2.2 U9.2
SCK: length 5
  Top Layer w0.254: R11.2 41.71,33.48 U1.28
SCKR: length 4.8
  Top Layer w0.254: R11.1 41.66,42.8 42.34,43.49 42.34,44.92 U6.2
SS#: length 3.4
  Top Layer w0.254: U6.1 40.18,43.02 R16.2
SW1: length 41
  Top Layer w0.254: U1.24 55.37,29.97 56.64,28.7 61.34,28.7 61.52,28.88 61.52,31.44 60.2,32.77 60.2,41.53 58.42,43.31 53.34,43.31 48.51,48.13 SW1.2
TXD: length 50.7
  Top Layer w0.254: H3.3 H2.3 26.8,38.86 26.8,41.28 28.57,43.05 35.69,43.05 41.02,37.72 50.42,37.72 54.1,34.04 55.88,34.04 56.25,33.66 X2.1
  Top Layer w0.508: X2.1 U10.2 60.45,31.5 U1.22
UPDI: length 45.4
  Top Layer w0.508: H4.1 U19.4 86.79,38.81 84.33,41.28 69.98,41.28 68.07,39.37 U1.19
VUSB: length 5.4
  Top Layer w0.508: U4.2 45.22,19.56 U1.2
XTAL32K1: length 5.7
  Top Layer w0.508: X1.1 U8.2 U1.16
XTAL32K2: length 2.1
  Top Layer w0.508: U1.17 R9.1
$1N1189: length 3.2
  Top Layer w0.254: R2.1 18.84,16.55 LED1.1
$1N1310: length 4.3
  Top Layer w0.254: R3.1 27.9,12.06 Q1.2
$1N1315: length 4.1
  Top Layer w0.254: Q1.3 22.73,16.64 LED1.2
$1N2118: length 5.1
  Top Layer w0.508: R4.2 46.4,54.62 SW1.1
$1N2146: length 5
  Top Layer w0.508: R5.1 50.51,49.8 SW1.3
$1N2686: length 5.1
  Top Layer w0.508: X1.2 U7.2 75.65,39.29 73.15,39.29
$1N3199: length 47.7
  Top Layer w0.254: H2.2 30.73,38.99 32,40.26 35.56,40.26 37.47,38.35 37.47,34.94 35.54,33.02 26.92,33.02 22.1,37.85 H5.1 22.22,48.01 22.22,52.05 DSUB1.3
$1N3303: length 47
  Top Layer w0.254: DSUB1.2 27.18,53.12 H5.3 27.18,45.72 25.87,44.41 25.87,43.27 arc(25.79,43.09) 25.62,43.02 25.27,43.02 arc(25.02,42.77) 25.27,42.52 25.62,42.52 arc(25.87,42.27) 25.62,42.02 25.27,42.02 arc(25.02,41.77) 25.27,41.52 25.62,41.52 arc(25.87,41.27) 25.62,41.02 25.27,41.02 arc(25.02,40.77) 25.27,40.52 25.62,40.52 arc(25.87,40.27) 25.62,40.02 25.27,40.02 arc(25.02,39.77) 25.27,39.52 25.62,39.52 arc(25.87,39.27) 25.62,39.02 25.27,39.02 arc(25.02,38.77) 25.27,38.52 25.62,38.52 arc(25.87,38.27) 25.62,38.02 25.27,38.02 arc(25.02,37.77) 25.27,37.52 25.62,37.52 arc(25.87,37.27) 25.62,37.02 25.27,37.02 arc(25.02,36.77) 25.27,36.52 25.62,36.52 arc(25.79,36.45) 25.87,36.27 25.87,35.22 27.21,33.88 35.4,33.88 36.7,35.18 36.7,38.23 35.94,38.99 H3.2
$1N7708: length 5.4
  Top Layer w1.27: LED2.1 17.78,42.8 18.42,42.16 R15.1
$1N7767: length 15.3
  Top Layer w0.254: U1.1 39.24,28.05 R16.1
$1N9356: length 5.3
  Top Layer w0.508: BTN_USR.1 76.37,51.46 76.37,55.63
$1N9378: length 5.4
  Top Layer w0.508: SW3.1 84.16,9.97 R10.2

## Copper pours and planes (outline as drawn; the poured copper is in the pictures)
5V0 on Top Layer: -2.36,65.54 103.94,65.54 103.94,-1.9 -2.36,-1.9
GND on Top Layer: 54.06,42.15 68.03,42.15 68.03,27.67 54.06,27.67
GND on Top Layer: 73.28,41.4 89.92,41.4 89.92,25.91 73.28,25.91
GND on Bottom Layer: -1.78,66.42 104.52,66.42 104.52,-1.02 -1.78,-1.02

## Text on the board
Top Silkscreen Layer: +  - | RXD | TXD | GNDx2 | . . 5V0 . . | . . GND . . | SS# SCK MISO MOSI | GND | 5V0 | < BARREL | USB-C > | FERRITE | 0 .  .  .  .  .  . 7 | PORT D | VREFA | RESET | PROG / V1 | PROG / V2 | POWER | LED | SPI | SWITCH | BUTTON | version 0.02 | AVR64DU28
